# EAGLE design ltc4063-test (EAGLE 9.4.0)
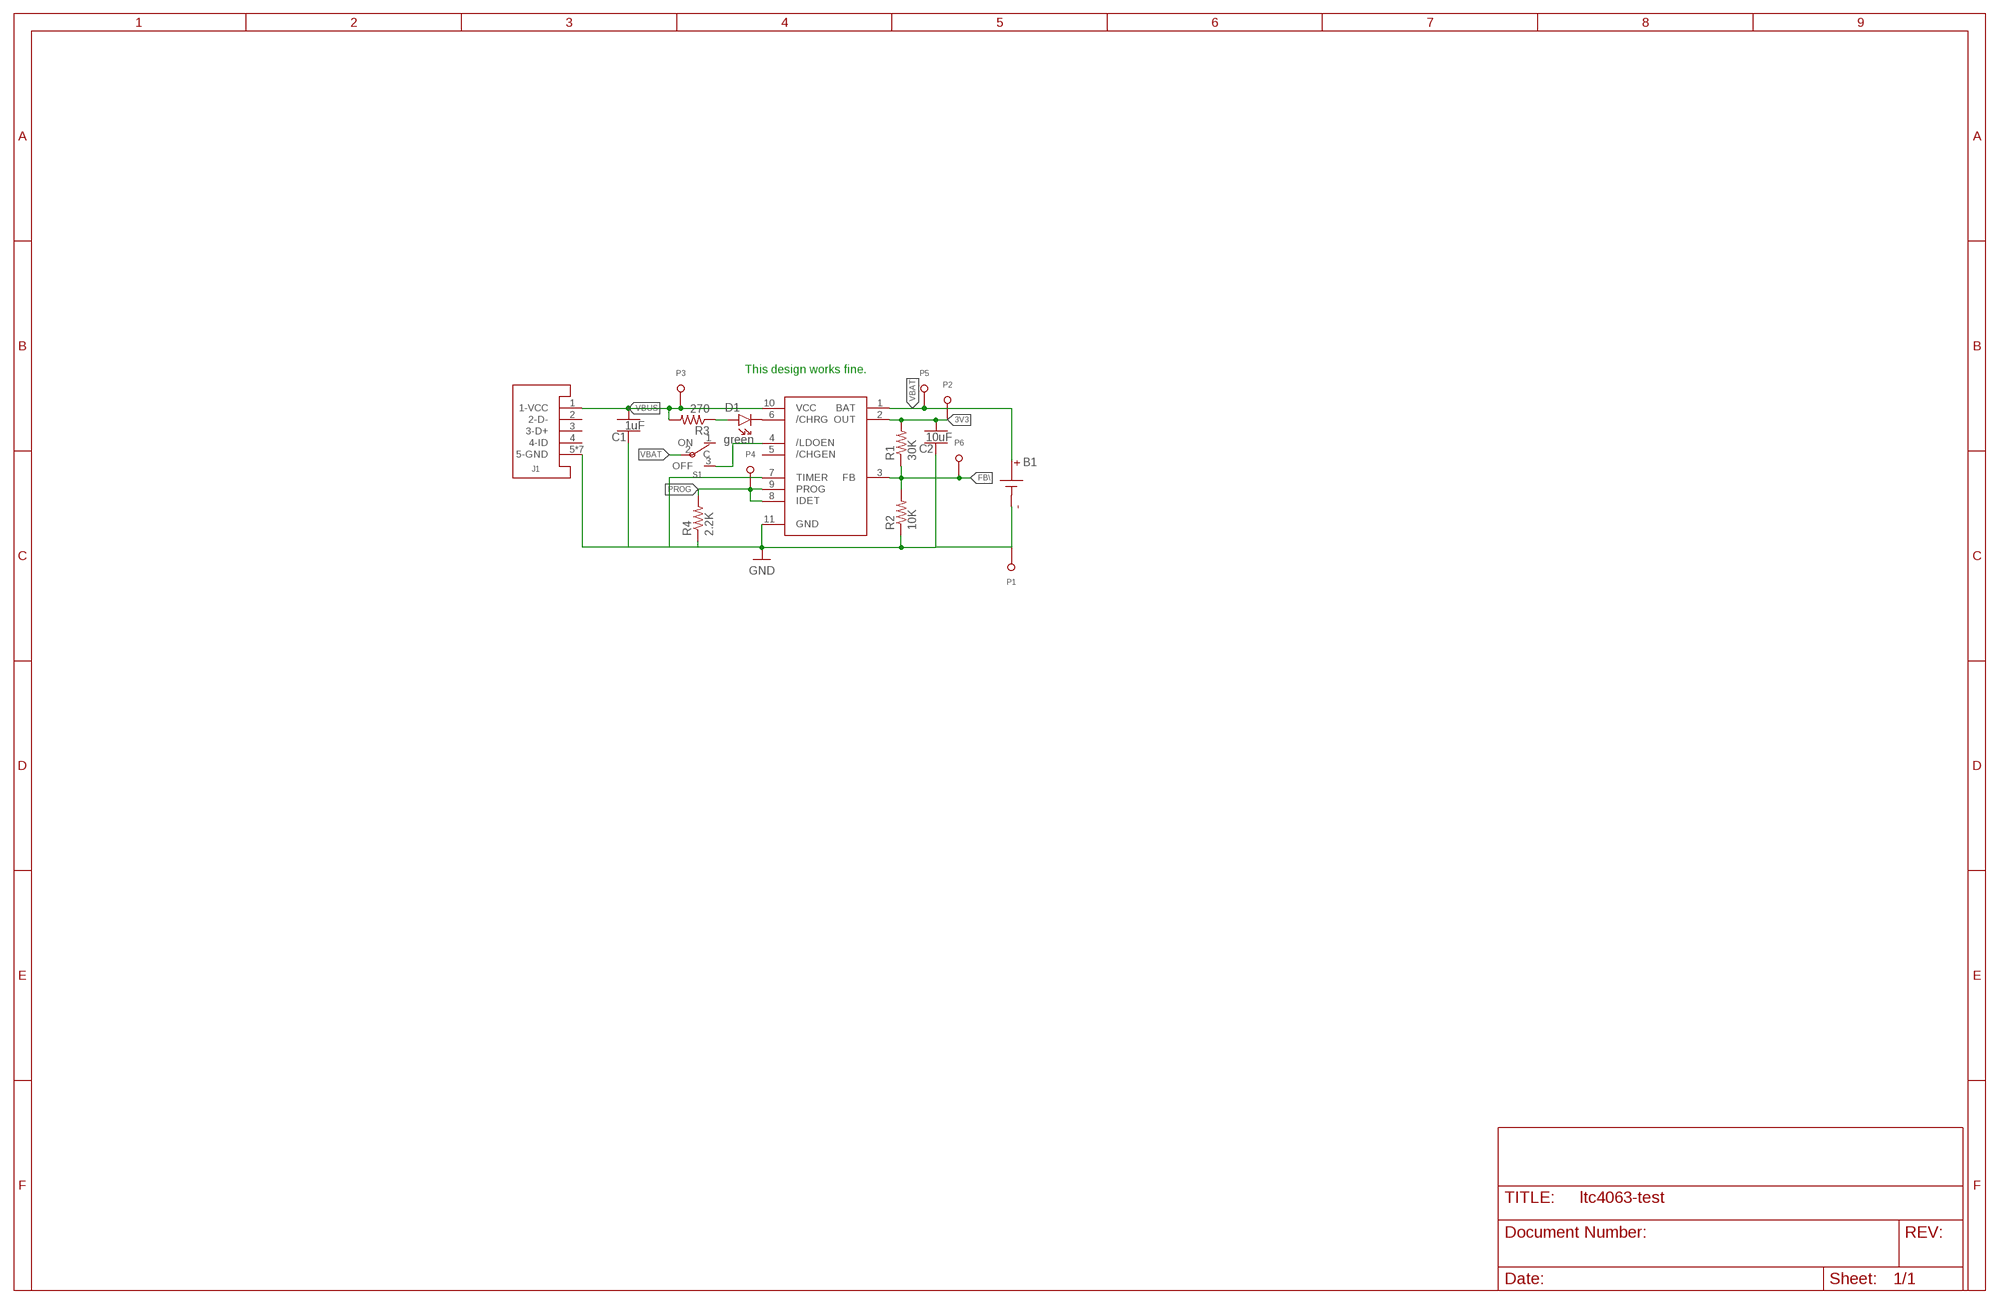
[diagram p0: schematic, sheet 1]
FRAME1 (FRAME_B_L): CREATOR: Unknown; DIST: Unknown; DISTPN: Unknown

## Parts
B1  BATTERY-SPRING-SMD  [WIRE-TERMINAL-1X2-2.5MM-SMD-AVX-009276002021106]
C1  1uF  CAPACITOR-NP_SMD-2012-0805_CERAMIC-1UF  [CAPC2012X140_HS]
C2  10uF  CAPACITOR-NP_SMD-2012-0805_CERAMIC-10UF  [CAPC2012X140_HS]
D1  green  DIODE-LED_SMD-2012-0805-GREEN  [LEDSC125X200X120-2_HS]
J1  USB-MICROA-AMPHENOL-10118192-0001LF  [USB-MICROA-10118192-0001LF]
P1  TEST-POINT  [TEST-POINT-KEYSTONE-5000]
P2  TEST-POINT  [TEST-POINT-KEYSTONE-5000]
P3  TEST-POINT  [TEST-POINT-KEYSTONE-5000]
P4  TEST-POINT  [TEST-POINT-KEYSTONE-5000]
P5  TEST-POINT  [TEST-POINT-KEYSTONE-5000]
P6  TEST-POINT  [TEST-POINT-KEYSTONE-5000]
R1  30K  RESISTOR_SMD-2012-0805-30K  [RESC2012X60_HS]
R2  10K  RESISTOR_SMD-2012-0805-10K  [RESC2012X60_HS]
R3  270  RESISTOR_SMD-2012-0805-270  [RESC2012X60_HS]
R4  2.2K  RESISTOR_SMD-2012-0805-2.2K  [RESC2012X60_HS]
S1  POWER-SWITCH-MFS201N-9-Z-SMD-VERTICAL  [JS102011JCQN]
U1  LIPO-VREG-LTC4063  [SON50P300X300X80-11T165X238]

## Nets
3V3 [HIGH-I]: C2.2 P2.T R1.2 U1.2(OUT)
FB\: P6.T R1.1 R2.2 U1.3(FB)
GND: B1.2A(N) B1.2B(N) C1.1 C2.1 J1.5(5-GND) J1.6(5-GND) J1.7(5-GND) J1.8(5-GND) J1.9(5-GND) J1.10(5-GND) J1.11(5-GND) P1.T R2.1 R4.1 U1.7(TIMER) U1.11(GND)
N$1: S1.3(OFF) U1.4(/LDOEN)
N$5: D1.C U1.6(/CHRG)
N$6: D1.A R3.1
PROG: P4.T R4.2 U1.8(IDET) U1.9(PROG)
VBAT [HIGH-I]: B1.1A(P) B1.1B(P) P5.T S1.2(C) U1.1(BAT)
VBUS [HIGH-I]: C1.2 J1.1(1-VCC) P3.T R3.2 U1.10(VCC)
Unconnected: J1.2(2-D-) J1.3(3-D+) J1.4(4-ID) S1.1(ON) U1.5(/CHGEN)

## Notes on the sheet
- This design works fine.

## Library data of the parts
B1 = quadparts_prebuilt:BATTERY: Connections for a battery.; CREATOR: Swanson; DIST: DIGIKEY; DISTPN: 478-6169-1-ND; MOUNTING: SMD; PIN1: +; PIN2: -
C1 = quadparts_prebuilt:CAPACITOR-NP_: Nonpolarized capacitor; CREATOR: Swanson; DIST: Digikey; DISTPN: 587-1281-1-ND; MFR: Taiyo Yuden; MOUNTING: SMD; MPN: TMK212B7105KG-T; REVIEWER: Swanson
C2 = quadparts_prebuilt:CAPACITOR-NP_: Nonpolarized capacitor; CREATOR: Swanson; DIST: Digikey; DISTPN: 445-5984-1-ND; MOUNTING: SMD; REVIEWER: Swanson
D1 = quadparts_prebuilt:DIODE-LED_: Light emitting diode; CREATOR: Swanson; DIST: Digikey; DISTPN: 160-1179-1-ND; MFR: Lite-On Inc; MOUNTING: SMD; MPN: LTST-C170GKT; REVIEWER: Swanson
J1 = RemoteParts:USB; CREATOR: Swanson; DIST: DIGIKEY; DISTPN: 609-4613-1-ND; MOUNTING: SMD
P1-P6 = RemoteParts:TEST-POINT; CREATOR: Swanson; DIST: DIGIKEY; DISTPN: 36-5001-ND; MOUNTING: TH
R1 = quadparts_prebuilt:RESISTOR_: Resistor; CREATOR: Swanson; DIST: DIGIKEY; DISTPN: YAG3721CT-ND; MOUNTING: SMD
R2 = quadparts_prebuilt:RESISTOR_: Resistor; CREATOR: Swanson; DIST: Digikey; DISTPN: 311-10KARCT-ND; MFR: Yageo; MOUNTING: SMD; MPN: RC0805JR-0710KL; REVIEWER: Swanson
R3 = quadparts_prebuilt:RESISTOR_: Resistor; CREATOR: SWANSON; DIST: DIGIKEY; DISTPN: 311-270ARCT-ND; MOUNTING: SMD
R4 = quadparts_prebuilt:RESISTOR_: Resistor; CREATOR: SWANSON; DIST: DIGIKEY; DISTPN: YAG3776CT-ND; MOUNTING: SMD
S1 = RemoteParts:POWER-SWITCH-MFS201N-9-Z; CREATOR: Swanson; DIST: DIGIKEY; DISTPN: CKN10721CT-ND; MOUNTING: SMD
U1 = RemoteParts:LIPO-VREG-LTC4063; CREATOR: Swanson; DIST: DIGIKEY; DISTPN: LTC4063EDD#PBF-ND; MOUNTING: SMD

## Net classes
1 HIGH-I: width 0.254 mm, drill 0.178 mm

## Board
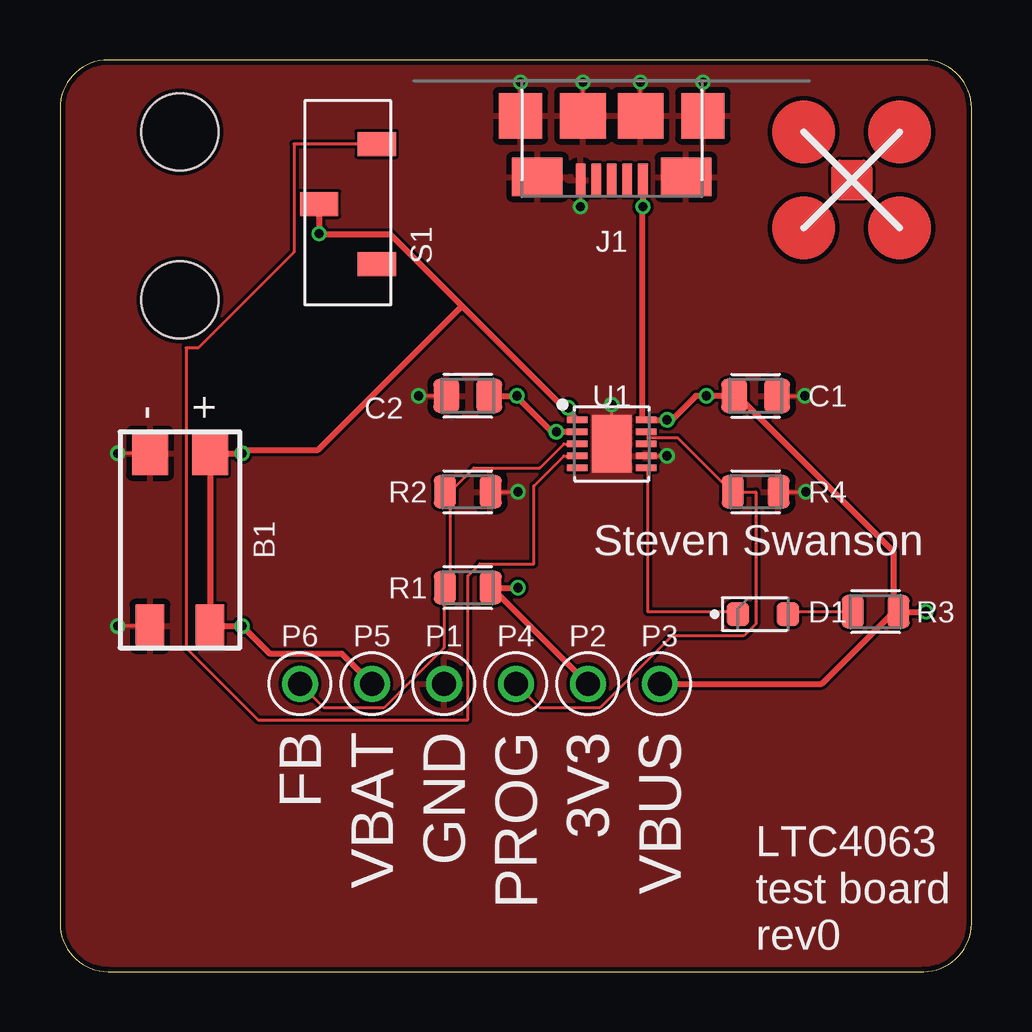
[diagram p1: board, top side]
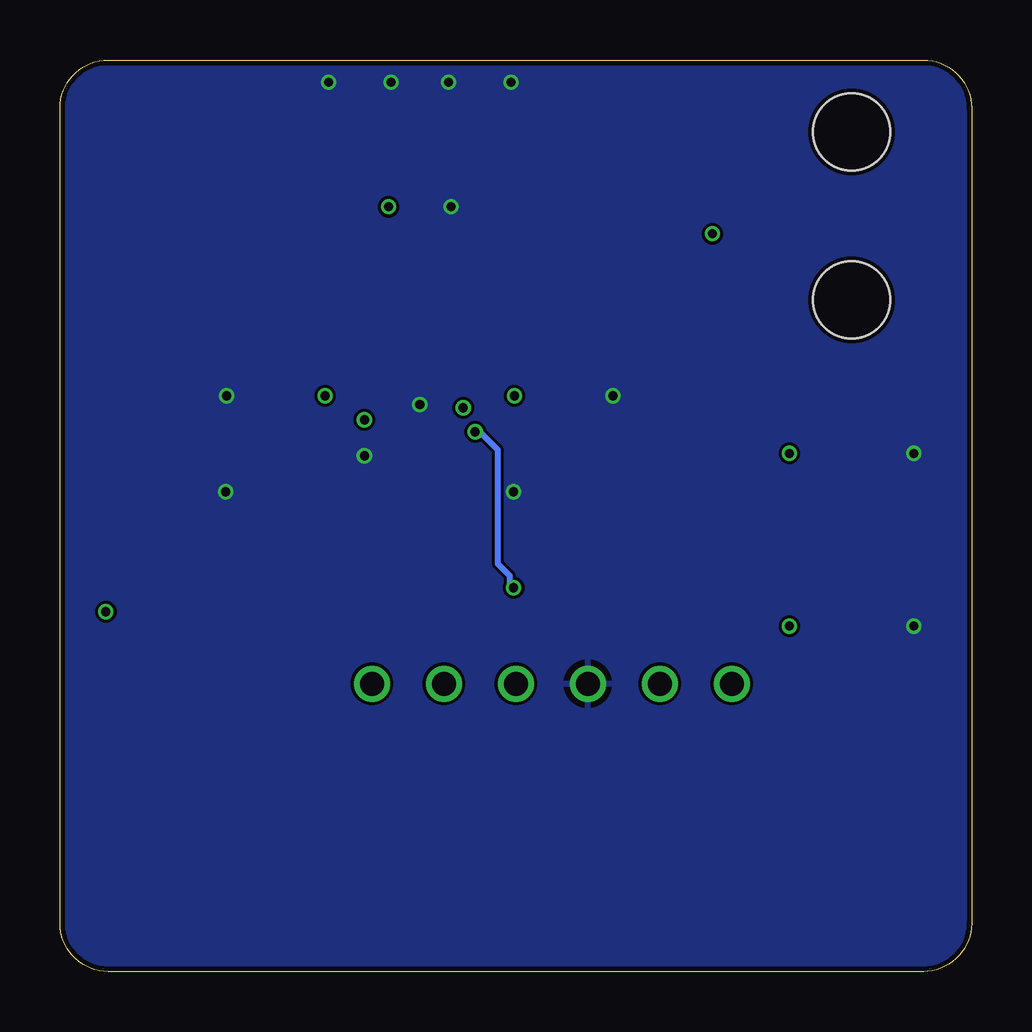
[diagram p2: board, bottom side, seen from below]

Size 38 x 38 mm. Coordinates in mm from the lower left corner, seen from the top.
Outline: 0,36 0,2 arc90 2,0 36,0 arc90 38,2 38,36 arc90 36,38 2,38 arc90 0,36
Copper layers (1*16): Top 0.035559375mm / dielectric 1.501140625mm / Bottom 0.035559375mm
Design rules "jlcpcb-4layer-5mil-small-cream *": minimum track width 5mil, minimum drill 0.2mm, track to track 5mil, track to pad 5mil, pad to pad 5mil, via to via 5mil, smd to smd 5mil, copper to edge 0.2mm, drill to drill 10mil, minimum pad ring 3mil, minimum via ring 5mil, stop-mask expansion 0.05mm, vias tented up to drill 0.45mm, thermal gap 10mil
Holes 3.2 mm at 5,28 5,35

### Footprints (pad centres in the part's own frame; a part is rotated, then mirrored left to right if it is on the bottom)
WIRE-TERMINAL-1X2-2.5MM-SMD-AVX-009276002021106 = smd 1.8 x 1.5: 1A 3.6,-1.25; 2A 3.6,1.25 | smd 1.8 x 1.2: 1B -3.6,-1.25; 2B -3.6,1.25
CAPC2012X140_HS = smd 1.08 x 1.42: 1 -0.895,0; 2 0.895,0
LEDSC125X200X120-2_HS = smd 0.94 x 0.99: A -0.345,-0.9; C 1.745,-0.9
USB-MICROA-10118192-0001LF = smd 0.4 x 1.35: 1 -1.3,0; 2 -0.65,0; 3 0,0; 4 0.65,0; 5 1.3,0 | smd 2.1 x 1.6: 6 3.1,-0.125; 7 -3.1,-0.125 | smd 1.8 x 1.9: 8 -3.8,-2.675; 11 3.8,-2.675 | smd 1.9 x 1.9: 9 1.2,-2.675; 10 -1.2,-2.675
TEST-POINT-KEYSTONE-5000 = drill 1: T 0,0
RESC2012X60_HS = smd 0.92 x 1.38: 1 -0.955,0; 2 0.955,0
JS102011JCQN = smd 1 x 1.6: 1 -2.5,-1.2; 2 0,1.2; 3 2.5,-1.2
SON50P300X300X80-11T165X238 = smd 0.86 x 0.27: 1 -1.435,1; 2 -1.435,0.5; 3 -1.435,0; 4 -1.435,-0.5; 5 -1.435,-1; 6 1.435,-1; 7 1.435,-0.5; 8 1.435,0; 9 1.435,0.5; 10 1.435,1 | smd 1.65 x 2.38: 11 0,0

### Placement (x,y rotation side)
B1  5,18 90 top
C1  29,24 180 top
C2  17,24 0 top
D1  30,14 180 top
J1  23,33 180 top
P1  16,12 0 top
P2  22,12 0 top
P3  25,12 0 top
P4  19,12 0 top
P5  13,12 0 top
P6  10,12 0 top
R1  17,16 0 top
R2  17,20 180 top
R3  34,15 0 top
R4  29,20 180 top
S1  12,32 90 top
U1  23,22 0 top
U$1  [QUADCLASS_LOGO_SMALL]  33,33 0 top

### Tracks (layer width: path | path; a pad name or v marks a point on that pad's centre or on a via)
3V3  (via drill 0.38)
  Top 0.254: C2.2 19,24 | U1.2 v20.69,22.5 20.5,22.5 19,24 | 18,16 v19.09,16 | 19,24 v19.05,24 | 18,16 P2.T | 18,16 R1.2
  Bottom 0.254: v20.69,22.5 20.5,22.5 19.75,21.75 19.75,17 19.25,16.5 19.25,16 v19.09,16
FB\
  Top 0.127: U1.3 21,22 20,21 17.25,21 16.25,20 | 16.25,20 16.25,16 R1.1 16,16 16,13.5 13.5,11 11,11 P6.T | 16.25,20 R2.2
GND  (via drill 0.38)
  Top 0.127: B1.2B v2.4,14.4 | B1.2A v2.4,21.6 | J1.5 v21.7,31.88 | J1.8 v26.8,37.07 | J1.10 v24.2,37.07 | J1.9 v21.8,37.07 | J1.11 v19.2,37.07 | R4.1 v31.09,20 | C2.1 v14.95,24 | U1.7 v25.31,21.5 | U1.11 v23,23.64 | R2.1 v19.09,20 | C1.1 v31.05,24
  pour Top: -1,39 -1,-1.5 39,-1.5 39,39
  pour Bottom: -2,40 -2,-2.5 40,-2.5 40,40
N$1
  Top 0.127: U1.4 21,21.5 19.75,20.25 19.75,17 17.5,17 17,16.5 17,10.5 8.25,10.5 5.25,13.5 5.25,26 5.75,26 9.75,30 9.75,34.5 S1.3
N$5
  Top 0.127: U1.6 24.5,21 24.5,15 28.25,15 D1.C
N$6
  Top 0.127: R3.1 30.5,15 D1.A
PROG
  Top 0.127: 24.5,22.25 24.5,22.5 U1.9 | 24.5,22.25 24.5,22 U1.8 | 24.5,22.25 25.75,22.25 28,20 R4.2 29,20 29,14.5 28.5,14 25.5,14 22.5,11 20,11 P4.T
VBAT  (via drill 0.38)
  Top 0.254: U1.1 21.19,23.37 v21.19,23.5 21,23.5 16.75,27.75 | S1.2 v10.8,30.75 11,30.75 13.75,30.75 16.75,27.75 | P5.T 11.75,13.25 8.75,13.25 7.75,14.25 v7.59,14.4 B1.1B B1.1A v7.59,21.6 7.75,21.75 10.75,21.75 16.75,27.75
VBUS  (via drill 0.38)
  Top 0.254: J1.1 v24.3,31.88 24.25,31.75 24.25,23 U1.10 v25.31,23 25.5,23 26.5,24 v26.95,24 C1.2 28.25,24 34.75,17.5 34.75,15 | v36.09,15 R3.2 34.75,15 | 34.75,15 31.75,12 P3.T

### Text on the board
tPlace: Steven Swanson | FB | VBAT | GND | PROG | 3V3 | VBUS | LTC4063 / test board / rev0